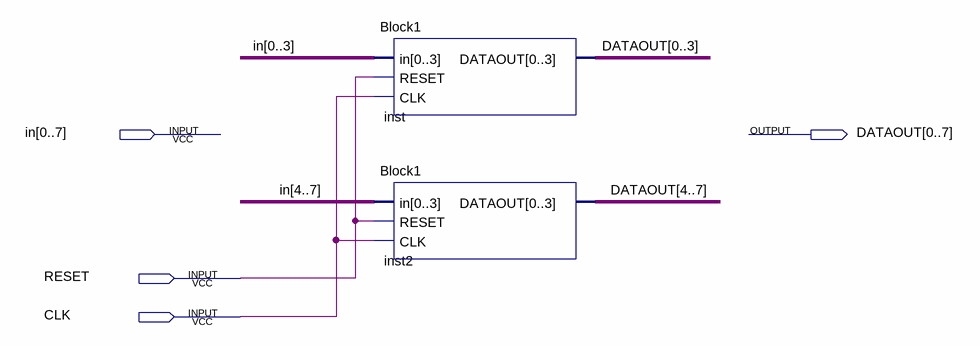
[diagram p0: schematic sheet]
// Quartus schematic Block2.bdf as structural Verilog: 2 symbols, 4 pins
module Block2 (
  input  [0:7] in,
  input  RESET,
  input  CLK,
  output [0:7] DATAOUT
);

  Block1 inst (.in(in[0:3]), .RESET(RESET), .CLK(CLK), .DATAOUT(DATAOUT[0:3]));
  Block1 inst2 (.in(in[4:7]), .RESET(RESET), .CLK(CLK), .DATAOUT(DATAOUT[4:7]));
endmodule
